# EAGLE design trashotron-optical-neuron (EAGLE 9.6.2)
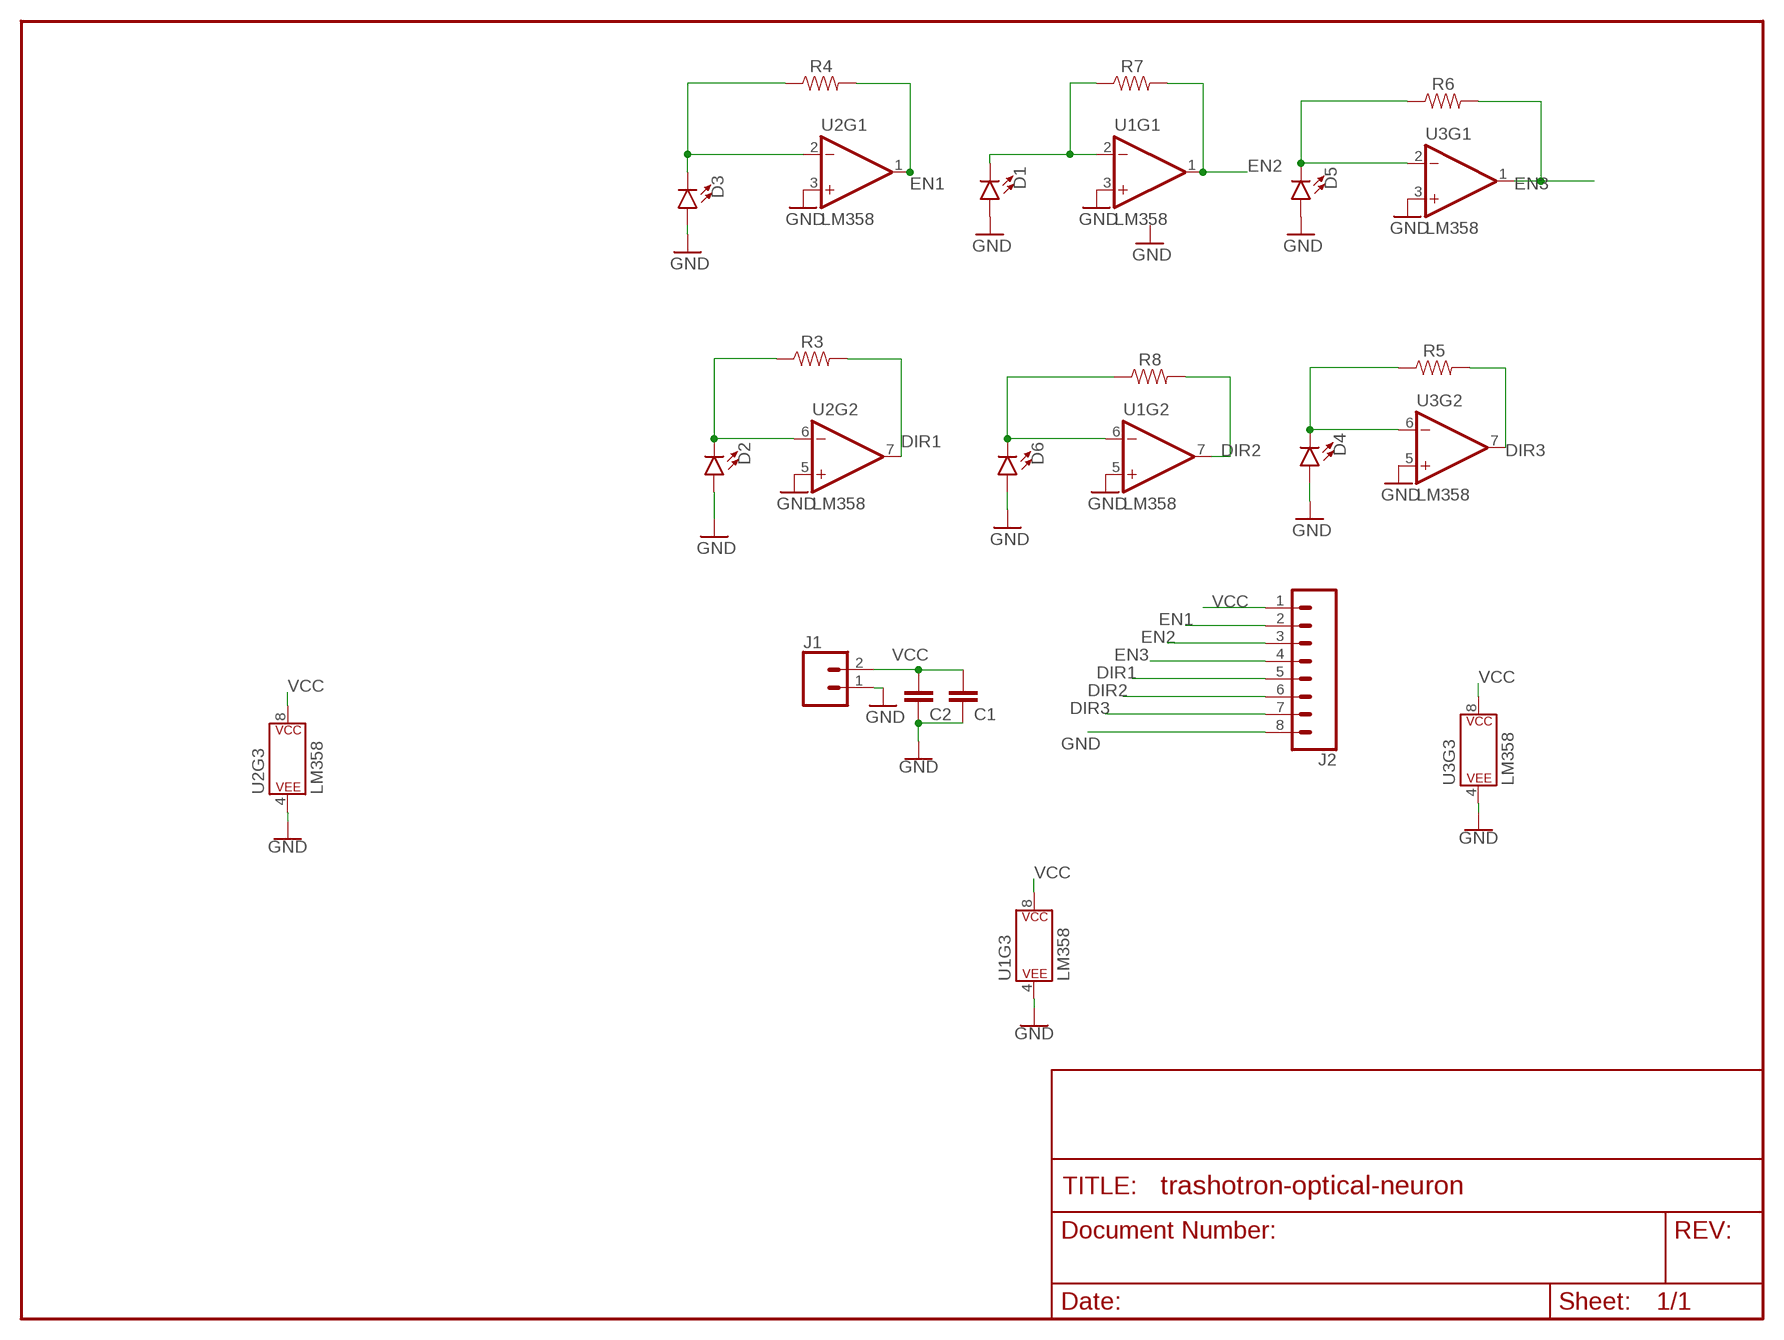
[diagram p0: schematic, sheet 1]

## Parts
C1  C-EU050-050X075  [C050-050X075]
C2  C-EU050-050X075  [C050-050X075]
D1  LED3MM  [LED_3MM]
D2  LED3MM  [LED_3MM]
D3  LED3MM  [LED_3MM]
D4  LED3MM  [LED_3MM]
D5  LED3MM  [LED_3MM]
D6  LED3MM  [LED_3MM]
J1  CONN_02  [1X02]
J2  CONN_08"  [1X08]
R3  RESISTORAXIAL-0.3  [AXIAL-0.3]
R4  RESISTORAXIAL-0.3  [AXIAL-0.3]
R5  RESISTORAXIAL-0.3  [AXIAL-0.3]
R6  RESISTORAXIAL-0.3  [AXIAL-0.3]
R7  RESISTORAXIAL-0.3  [AXIAL-0.3]
R8  RESISTORAXIAL-0.3  [AXIAL-0.3]
U1  LM358  [DIP08]
U2  LM358  [DIP08]
U3  LM358  [DIP08]

## Nets
DIR1: J2.5 R3.P$2 U2.7(OUT)
DIR2: J2.6 R8.P$2 U1.7(OUT)
DIR3: J2.7 R5.P$2 U3.7(OUT)
EN1: J2.2 R4.P$2 U2.1(OUT)
EN2: J2.3 R7.P$2 U1.1(OUT)
EN3: J2.4 R6.P$2 U3.1(OUT)
GND: C1.1 C2.1 D1.A D2.A D3.A D4.A D5.A D6.A J1.1 J2.8 U1.3(+IN) U1.4(P$V-) U1.5(+IN) U2.3(+IN) U2.4(P$V-) U2.5(+IN) U3.3(+IN) U3.4(P$V-) U3.5(+IN)
N$1: D1.K(C) R7.P$1 U1.2(-IN)
N$4: D3.K(C) R4.P$1 U2.2(-IN)
N$5: D2.K(C) R3.P$1 U2.6(-IN)
N$6: D4.K(C) R5.P$1 U3.6(-IN)
N$7: D5.K(C) R6.P$1 U3.2(-IN)
N$8: D6.K(C) R8.P$1 U1.6(-IN)
VCC: C1.2 C2.2 J1.2 J2.1 U1.8(P$V+) U2.8(P$V+) U3.8(P$V+)

## Library data of the parts
C1 C2 = rcl:C-EU: CAPACITOR, European symbol; SPICEPREFIX: C
D1-D6 = SparkFun-LED:LED: LED (Generic) Standard schematic elements and footprints for 5mm, 3mm, 1206, and 0603 sized LEDs. Generic LEDs with no color specified.; PROD_ID: DIO-08794
J1 = SparkFun-Connectors:CONN_02: Multi connection point. Often used as Generic Header-pin footprint for 0.1 inch spaced/style header connections On any of the 0.1 inch spaced packages, you can populate with these: Break Away Headers - Straight <https://www.sparkfun.com/products/116> (PRT-00116) Break Away Male Headers - Right Angle <https://www.sparkfun.com/products/553> (PRT-00553) Female Headers <https://www.sparkfun.com/products/115> (PRT-00115) Break Away Headers - Machine Pin <https://www.sparkfun.com/products/117> (PRT-00117) Break Away Female Headers - Swiss Machine Pin <https://www.sparkfun.com/products/743> (PRT-00743) For SCREWTERMINALS and SPRING TERMINALS visit here: Screw Terimnals on SparkFun.com <https://www.sparkfun.com/search/results?term=Screw+Terminals> (5mm/3.5mm/2.54mm spacing) This device is also useful as a general connection point to wire up your design to another part of your project. Our various solder wires solder well into these plated through hole pads. Hook-Up Wire - Assortment (Stranded, 22 AWG) <https://www.sparkfun.com/products/11375> (PRT-11375) Hook-Up Wire - Assortment (Solid Core, 22 AWG) <https://www.sparkfun.com/products/11367> (PRT-11367) View the entire wire category on our website here <https://www.sparkfun.com/categories/141> Special notes: Molex polarized connector foot print use with: PRT-08233 with associated crimp pins and housings. 2.54_SCREWTERM for use with PRT-10571. 3.5mm Screw Terminal footprints for PRT-08084 5mm Screw Terminal footprints for use with PRT-08432
J2 = SparkFun-Connectors:CONN_08: Multi connection point. Often used as Generic Header-pin footprint for 0.1 inch spaced/style header connections On any of the 0.1 inch spaced packages, you can populate with these: Break Away Headers - Straight <https://www.sparkfun.com/products/116> (PRT-00116) Break Away Male Headers - Right Angle <https://www.sparkfun.com/products/553> (PRT-00553) Female Headers <https://www.sparkfun.com/products/115> (PRT-00115) Break Away Headers - Machine Pin <https://www.sparkfun.com/products/117> (PRT-00117) Break Away Female Headers - Swiss Machine Pin <https://www.sparkfun.com/products/743> (PRT-00743) Arduino Stackable Header - 8 Pin <https://www.sparkfun.com/products/9279> (PRT-09279) For SCREWTERMINALS and SPRING TERMINALS visit here: Screw Terimnals on SparkFun.com <https://www.sparkfun.com/search/results?term=Screw+Terminals> (5mm/3.5mm/2.54mm spacing) This device is also useful as a general connection point to wire up your design to another part of your project. Our various solder wires solder well into these plated through hole pads. Hook-Up Wire - Assortment (Stranded, 22 AWG) <https://www.sparkfun.com/products/11375> (PRT-11375) Hook-Up Wire - Assortment (Solid Core, 22 AWG) <https://www.sparkfun.com/products/11367> (PRT-11367) View the entire wire category on our website here <https://www.sparkfun.com/categories/141> Special notes: Molex polarized connector foot print use with SKU : PRT-08231 with associated crimp pins and housings. 1MM SMD Version SKU: PRT-10208 NOTES ON THE VARIANTS LOCK and LOCK_LONGPADS... This footprint was designed to help hold the alignment of a through-hole component (i.e. 6-pin header) while soldering it into place. You may notice that each hole has been shifted either up or down by 0.005 of an inch from it's more standard position (which is a perfectly straight line). This slight alteration caused the pins (the squares in the middle) to touch the edges of the holes. Because they are alternating, it causes a "brace" to hold the component in place. 0.005 has proven to be the perfect amount of "off-center" position when using our standard breakaway headers. Although looks a little odd when you look at the bare footprint, once you have a header in there, the alteration is very hard to notice. Also,if you push a header all the way into place, it is covered up entirely on the bottom side.; PROD_ID: CONN-08438
R3-R8 = SparkFun-Resistors:RESISTOR: Generic Resistor Package
U1-U3 = SparkFun-IC-Amplifiers:LM358: LM358 Jellybean op-amp Datasheet <http://www.sparkfun.com/datasheets/Components/General/LM358.pdf> SparkFun Products Op-Amp (Thru-Hole) - LM358 <https://www.sparkfun.com/products/9456> (COM-09456); PROD_ID: IC-09172

## Net classes
0 default: width 0.203 mm
1 vcc: width 0.254 mm

## Board
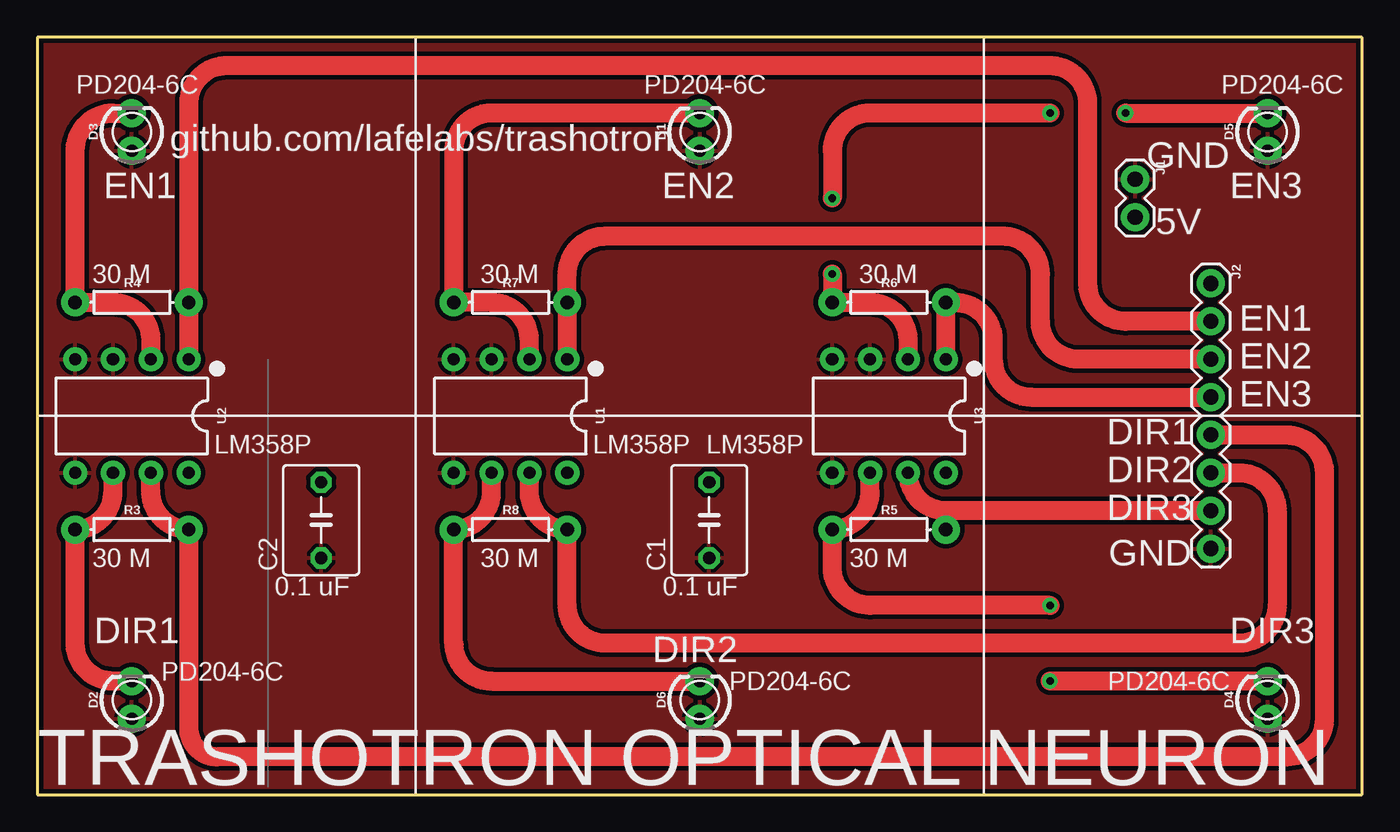
[diagram p1: board, top side]
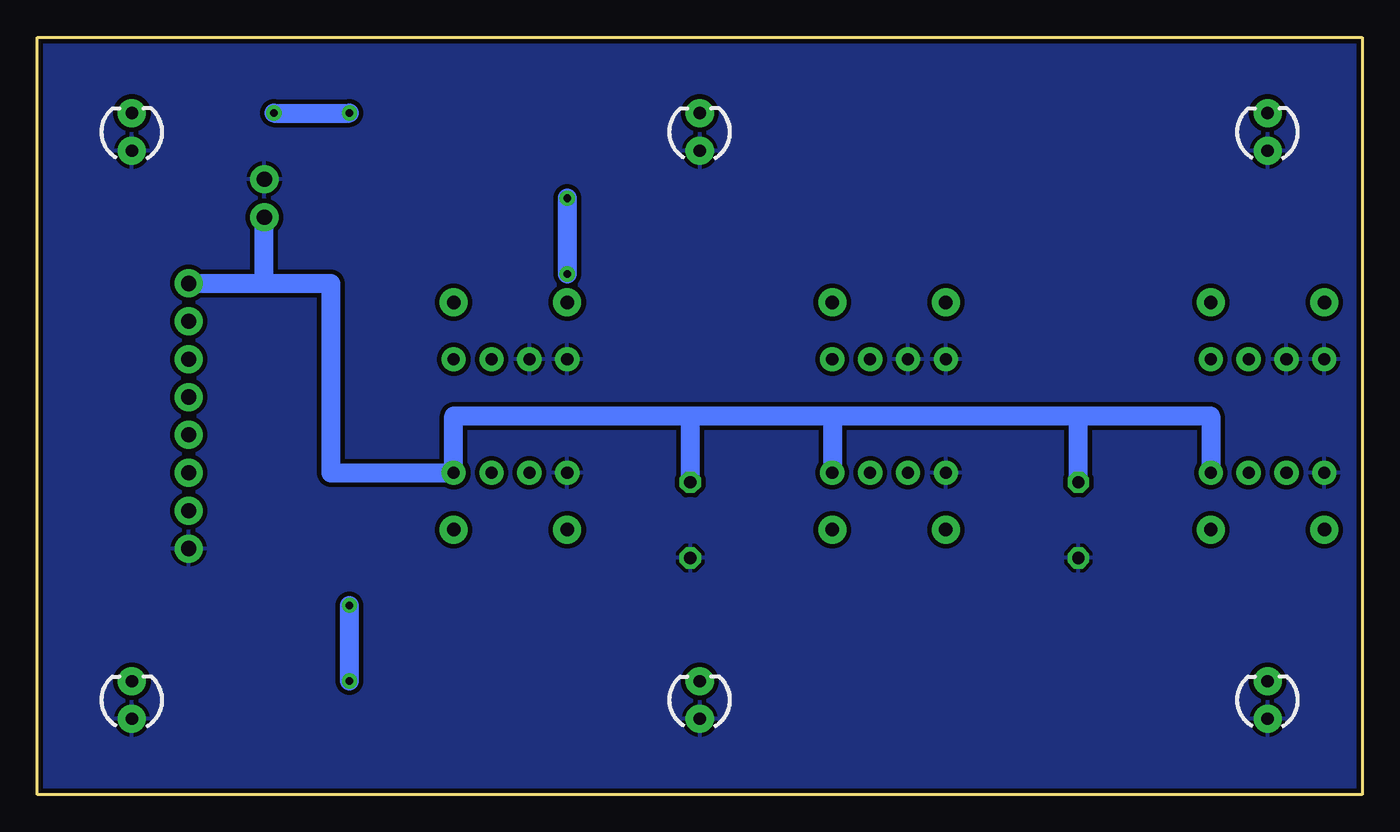
[diagram p2: board, bottom side, seen from below]

Size 88.9 x 50.8 mm. Coordinates in mm from the lower left corner, seen from the top.
Outline: 0,50.8 0,0 88.9,0 88.9,50.8 0,50.8
Copper layers (1*16): Top 0.035mm / dielectric 1.5mm / Bottom 0.035mm
Design rules "default": minimum track width 8mil, minimum drill 20mil, track to track 8mil, track to pad 8mil, pad to pad 8mil, via to via 8mil, smd to smd 8mil, copper to edge 10mil, drill to drill 8mil, minimum pad ring 12mil, minimum via ring 10mil, stop-mask expansion 4mil, vias tented up to drill 25mil, thermal gap 10mil

### Footprints (pad centres in the part's own frame; a part is rotated, then mirrored left to right if it is on the bottom)
C050-050X075 = drill 0.813 octagon: 1 -2.54,0; 2 2.54,0
LED_3MM = drill 0.813 pad 1.88: A -1.27,0; K 1.27,0
1X02 = drill 1.016 pad 1.88: 1 0,0; 2 2.54,0
1X08 = drill 1.016 pad 1.88: 1 0,0; 2 2.54,0; 3 5.08,0; 4 7.62,0; 5 10.16,0; 6 12.7,0; 7 15.24,0; 8 17.78,0
AXIAL-0.3 = drill 0.9 pad 1.88: P$1 -3.81,0; P$2 3.81,0
DIP08 = drill 0.813 pad 1.626: 1 -3.81,-3.81; 2 -1.27,-3.81; 3 1.27,-3.81; 4 3.81,-3.81; 5 3.81,3.81; 6 1.27,3.81; 7 -1.27,3.81; 8 -3.81,3.81

### Placement (x,y rotation side)
C1  45.09,18.41 90 top
C2  19.05,18.41 90 top
D1  44.45,44.45 90 top
D2  6.35,6.35 90 top
D3  6.35,44.45 90 top
D4  82.55,6.35 90 top
D5  82.55,44.45 90 top
D6  44.45,6.35 90 top
J1  73.66,41.27 270 top
J2  78.74,34.29 270 top
R3  6.35,17.78 0 top
R4  6.35,33.02 0 top
R5  57.15,17.78 0 top
R6  57.15,33.02 0 top
R7  31.75,33.02 0 top
R8  31.75,17.78 0 top
U1  31.75,25.4 180 top
U2  6.35,25.4 180 top
U3  57.15,25.4 180 top

### Tracks (layer width: path | path; a pad name or v marks a point on that pad's centre or on a via)
DIR1
  Top 1.27: J2.5 83.82,24.13 arc-90 86.36,21.59 86.36,5.08 arc-90 83.82,2.54 12.06,2.54 arc-90 10.16,4.45 R3.P$2 arc-90 7.62,20.32 U2.7
DIR2
  Top 1.27: J2.6 80.64,21.59 arc-90 83.19,19.05 83.19,12.7 arc-90 80.64,10.16 38.1,10.16 arc-90 35.56,12.7 R8.P$2 arc-90 33.02,20.32 U1.7
DIR3
  Top 1.27: J2.7 60.96,19.05 | U3.7 arc90 60.96,19.05 | R5.P$2 60.96,19.05
EN1
  Top 1.27: J2.2 73.03,31.75 arc-90 70.48,34.29 70.48,46.35 arc90 67.94,48.9 12.7,48.9 arc90 10.16,46.35 R4.P$2 U2.1
EN2
  Top 1.27: J2.3 69.85,29.21 arc-90 67.31,31.75 67.31,34.92 arc90 64.77,37.47 38.1,37.47 arc90 35.56,34.92 R7.P$2 U1.1
EN3
  Top 1.27: J2.4 66.67,26.67 arc-90 64.14,29.21 64.14,30.48 arc90 61.59,33.02 R6.P$2 U3.1
GND
  pour Top (isolate 0.305): 0,50.8 88.9,50.8 88.9,0 0,0
  pour Bottom (isolate 0.305): 0,50.8 88.9,50.8 88.9,0 0,0
N$1
  Top 1.27: U1.2 33.02,30.48 arc90 30.48,33.02 R7.P$1 27.94,43.18 arc-90 30.48,45.72 D1.K
N$4
  Top 1.27: U2.2 7.62,30.48 arc90 5.08,33.02 R4.P$1 2.54,43.18 arc-90 5.08,45.72 D3.K
N$5
  Top 1.27: U2.6 5.08,20.32 arc-90 R3.P$1 2.54,10.16 arc90 5.08,7.62 D2.K
N$6  (via drill 0.51)
  Top 1.27: D4.K v67.94,7.62 | v67.94,12.7 55.88,12.7 arc-90 53.34,15.24 R5.P$1 arc90 55.88,20.32 U3.6
  Bottom 1.27: v67.94,7.62 v67.94,12.7
N$7  (via drill 0.51)
  Top 1.27: U3.2 58.42,30.48 arc90 55.88,33.02 R6.P$1 v53.34,34.92 | v67.94,45.72 55.88,45.72 arc90 53.34,43.18 v53.34,40.01 | v73.03,45.72 D5.K
  Bottom 1.27: v73.03,45.72 v67.94,45.72 | v53.34,40.01 v53.34,34.92
N$8
  Top 1.27: U1.6 30.48,20.32 arc-90 R8.P$1 27.94,10.16 arc90 30.48,7.62 D6.K
VCC
  Bottom 1.27: J2.1 73.66,34.29 | 73.66,34.29 69.22,34.29 69.22,21.59 U3.8 60.96,25.4 45.09,25.4 | 45.09,25.4 35.56,25.4 | 35.56,25.4 U1.8 | 35.56,25.4 19.05,25.4 | 19.05,25.4 10.16,25.4 U2.8 | C2.2 19.05,25.4 | C1.2 45.09,25.4 | 73.66,34.29 J1.2

### Text on the board
tPlace: PD204-6C | PD204-6C | PD204-6C | GND | github.com/lafelabs/trashotron | EN1 | EN2 | EN3 | 5V | 30 M | 30 M | 30 M | EN1 | EN2 | EN3 | LM358P | LM358P | LM358P | DIR1 | DIR2 | DIR3 | 30 M | 30 M | 30 M | GND | 0.1 uF | 0.1 uF | DIR1 | DIR3 | PD204-6C | DIR2 | PD204-6C | PD204-6C | TRASHOTRON OPTICAL NEURON
tValues: Tent Vias! | Arduino Wee v1.3